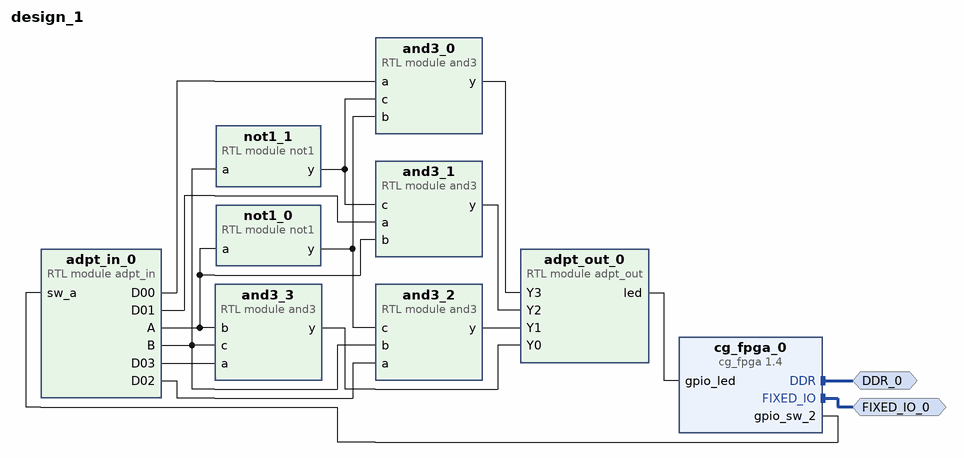
[diagram p0: block diagram of the top level]
# Vivado block design design_1, xc7z020clg400-1, Vivado 2025.2
create_bd_design design_1

create_bd_intf_port -mode Master -vlnv xilinx.com:display_processing_system7:fixedio_rtl:1.0 FIXED_IO_0
create_bd_intf_port -mode Master -vlnv xilinx.com:interface:ddrx_rtl:1.0 DDR_0

create_bd_cell -type ip -vlnv educg.net:user:cg_fpga:1.4 cg_fpga_0
create_bd_cell -type module -reference adpt_in adpt_in_0
create_bd_cell -type module -reference adpt_out adpt_out_0
create_bd_cell -type module -reference and3 and3_0
create_bd_cell -type module -reference and3 and3_1
create_bd_cell -type module -reference and3 and3_2
create_bd_cell -type module -reference and3 and3_3
create_bd_cell -type module -reference not1 not1_0
create_bd_cell -type module -reference not1 not1_1

# ---- connections ----

connect_bd_intf_net [get_bd_intf_ports DDR_0] [get_bd_intf_pins cg_fpga_0/DDR]
connect_bd_intf_net [get_bd_intf_ports FIXED_IO_0] [get_bd_intf_pins cg_fpga_0/FIXED_IO]
connect_bd_net [get_bd_pins adpt_in_0/A] [get_bd_pins not1_0/a] [get_bd_pins and3_1/b] [get_bd_pins and3_3/b]
connect_bd_net [get_bd_pins adpt_in_0/B] [get_bd_pins not1_1/a] [get_bd_pins and3_2/b] [get_bd_pins and3_3/c]
connect_bd_net [get_bd_pins adpt_in_0/D00] [get_bd_pins and3_0/a]
connect_bd_net [get_bd_pins adpt_in_0/D01] [get_bd_pins and3_1/a]
connect_bd_net [get_bd_pins adpt_in_0/D02] [get_bd_pins and3_2/a]
connect_bd_net [get_bd_pins adpt_in_0/D03] [get_bd_pins and3_3/a]
connect_bd_net [get_bd_pins adpt_out_0/led] [get_bd_pins cg_fpga_0/gpio_led]
connect_bd_net [get_bd_pins and3_0/y] [get_bd_pins adpt_out_0/Y3]
connect_bd_net [get_bd_pins and3_1/y] [get_bd_pins adpt_out_0/Y2]
connect_bd_net [get_bd_pins and3_2/y] [get_bd_pins adpt_out_0/Y1]
connect_bd_net [get_bd_pins and3_3/y] [get_bd_pins adpt_out_0/Y0]
connect_bd_net [get_bd_pins cg_fpga_0/gpio_sw_2] [get_bd_pins adpt_in_0/sw_a]
connect_bd_net [get_bd_pins not1_0/y] [get_bd_pins and3_0/b] [get_bd_pins and3_2/c]
connect_bd_net [get_bd_pins not1_1/y] [get_bd_pins and3_0/c] [get_bd_pins and3_1/c]

validate_bd_design
save_bd_design
